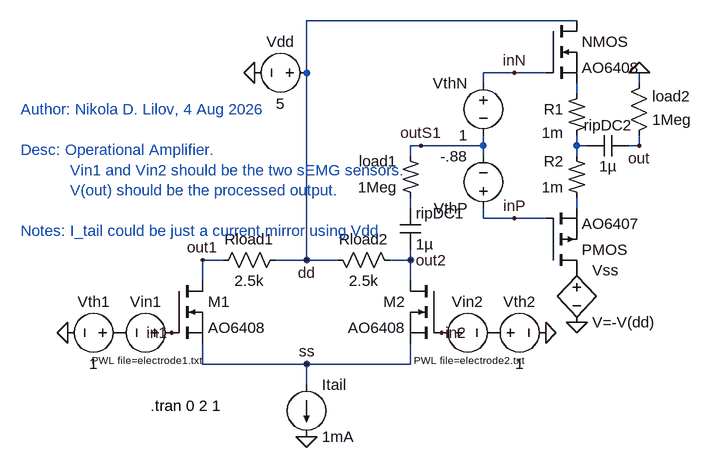
[diagram p0: schematic OpAMP.asc]
OpAMP.asc, the LTspice schematic file:
Version 4.1
SHEET 1 1040 680
WIRE 656 -352 240 -352
WIRE 240 -272 240 -352
WIRE 560 -272 512 -272
WIRE 608 -272 560 -272
WIRE 512 -256 512 -272
WIRE 752 -256 752 -272
WIRE 656 -240 656 -256
WIRE 416 -160 400 -160
WIRE 512 -160 512 -176
WIRE 512 -160 416 -160
WIRE 656 -160 656 -176
WIRE 672 -160 656 -160
WIRE 752 -160 752 -176
WIRE 752 -160 736 -160
WIRE 400 -144 400 -160
WIRE 512 -144 512 -160
WIRE 656 -144 656 -160
WIRE 400 -64 400 -80
WIRE 656 -64 656 -80
WIRE 512 -48 512 -64
WIRE 560 -48 512 -48
WIRE 608 -48 560 -48
WIRE 112 16 80 16
WIRE 240 16 240 -272
WIRE 240 16 192 16
WIRE 288 16 240 16
WIRE 400 16 400 0
WIRE 400 16 368 16
WIRE 80 48 80 16
WIRE 400 48 400 16
WIRE 80 176 80 144
WIRE 240 176 80 176
WIRE 400 176 400 144
WIRE 400 176 240 176
WIRE 240 208 240 176
FLAG 160 -272 0
FLAG 240 288 0
FLAG 32 128 in1
FLAG 448 128 in2
FLAG 80 16 out1
FLAG 400 16 out2
FLAG 240 16 dd
FLAG 240 176 ss
FLAG 656 112 0
FLAG 752 -272 0
FLAG 560 -272 inN
FLAG 560 -48 inP
FLAG 752 -160 out
FLAG 416 -160 outS1
FLAG -128 128 0
FLAG 608 128 0
SYMBOL voltage 48 128 R90
WINDOW 0 -32 56 VBottom 2
WINDOW 3 32 56 VTop 1
WINDOW 123 0 0 Left 0
WINDOW 39 0 0 Left 0
SYMATTR InstName Vin1
SYMATTR Value PWL file=electrode1.txt
SYMBOL nmos 32 48 R0
SYMATTR InstName M1
SYMATTR Value AO6408
SYMBOL current 240 208 R0
WINDOW 123 0 0 Left 0
WINDOW 39 0 0 Left 0
SYMATTR InstName Itail
SYMATTR Value 1mA
SYMBOL res 208 0 R90
WINDOW 0 0 56 VBottom 2
WINDOW 3 32 56 VTop 2
SYMATTR InstName Rload1
SYMATTR Value 2.5k
SYMBOL voltage 432 128 M90
WINDOW 0 -32 56 VBottom 2
WINDOW 3 32 56 VTop 1
WINDOW 123 0 0 Left 0
WINDOW 39 0 0 Left 0
SYMATTR InstName Vin2
SYMATTR Value PWL file=electrode2.txt
SYMBOL nmos 448 48 M0
SYMATTR InstName M2
SYMATTR Value AO6408
SYMBOL res 272 0 M90
WINDOW 0 0 56 VBottom 2
WINDOW 3 32 56 VTop 2
SYMATTR InstName Rload2
SYMATTR Value 2.5k
SYMBOL cap 384 0 M180
WINDOW 0 24 56 Left 2
WINDOW 3 24 8 Left 2
SYMATTR InstName ripDC1
SYMATTR Value 1µ
SYMBOL nmos 608 -352 R0
SYMATTR InstName NMOS
SYMATTR Value AO6408
SYMBOL pmos 608 32 M180
SYMATTR InstName PMOS
SYMATTR Value AO6407
SYMBOL res 736 -160 M180
WINDOW 0 36 76 Left 2
WINDOW 3 36 40 Left 2
SYMATTR InstName load2
SYMATTR Value 1Meg
SYMBOL voltage 512 -272 M0
WINDOW 123 0 0 Left 0
WINDOW 39 0 0 Left 0
SYMATTR InstName VthN
SYMATTR Value 1
SYMBOL voltage 512 -48 R180
WINDOW 123 0 0 Left 0
WINDOW 39 0 0 Left 0
SYMATTR Value -.88
SYMATTR InstName VthP
SYMBOL res2 672 -240 M0
SYMATTR InstName R1
SYMATTR Value 1m
SYMBOL res2 672 -80 R180
WINDOW 0 36 56 Left 2
WINDOW 3 36 16 Left 2
SYMATTR InstName R2
SYMATTR Value 1m
SYMBOL cap 672 -144 R270
WINDOW 0 32 32 VTop 2
WINDOW 3 0 32 VBottom 2
SYMATTR InstName ripDC2
SYMATTR Value 1µ
SYMBOL res2 416 -80 R180
WINDOW 0 36 56 Left 2
WINDOW 3 36 16 Left 2
SYMATTR InstName load1
SYMATTR Value 1Meg
SYMBOL voltage -32 128 R90
WINDOW 0 -32 56 VBottom 2
WINDOW 3 32 56 VTop 2
WINDOW 123 0 0 Left 0
WINDOW 39 0 0 Left 0
SYMATTR InstName Vth1
SYMATTR Value 1
SYMBOL voltage 512 128 R270
WINDOW 0 32 56 VTop 2
WINDOW 3 -32 56 VBottom 2
WINDOW 123 0 0 Left 0
WINDOW 39 0 0 Left 0
SYMATTR InstName Vth2
SYMATTR Value 1
SYMBOL voltage 256 -272 R90
WINDOW 0 -32 56 VBottom 2
WINDOW 3 32 56 VTop 2
WINDOW 123 0 0 Left 0
WINDOW 39 0 0 Left 0
SYMATTR InstName Vdd
SYMATTR Value 5
SYMBOL bv 656 16 R0
SYMATTR InstName Vss
SYMATTR Value V=-V(dd)
TEXT 0 240 Left 2 !.tran 0 2 1
TEXT -200 -216 Left 2 ;Author: Nikola D. Lilov, 4 Aug 2026\n \nDesc: Operational Amplifier.\n           Vin1 and Vin2 should be the two sEMG sensors.\n           V(out) should be the processed output.\n \nNotes: I_tail could be just a current mirror using Vdd.

The netlist it stands for:
* OpAMP.asc
Vin1 in1 P001 PWL file=electrode1.txt
M1 out1 in1 ss ss AO6408
Itail ss 0 1mA
Rload1 dd out1 2.5k
Vin2 in2 P002 PWL file=electrode2.txt
M2 out2 in2 ss ss AO6408
Rload2 dd out2 2.5k
C§ripDC1 out2 N003 1µ
M§NMOS dd inN N001 N001 AO6408
M§PMOS P003 inP N004 N004 AO6407
R§load2 out 0 1Meg
VthN inN outS1 1
VthP inP outS1 -.88
R1 N001 N002 1m
R2 N004 N002 1m
C§ripDC2 N002 out 1µ
R§load1 N003 outS1 1Meg
Vth1 P001 0 1
Vth2 P002 0 1
Vdd dd 0 5
B§Vss P003 0 V=-V(dd)
.model NMOS NMOS
.model PMOS PMOS
.lib standard.mos
.tran 0 2 1
* Author: Nikola D. Lilov, 4 Aug 2026
* Desc: Operational Amplifier.
*            Vin1 and Vin2 should be the two sEMG sensors.
*            V(out) should be the processed output.
* Notes: I_tail could be just a current mirror using Vdd.
.backanno
.end